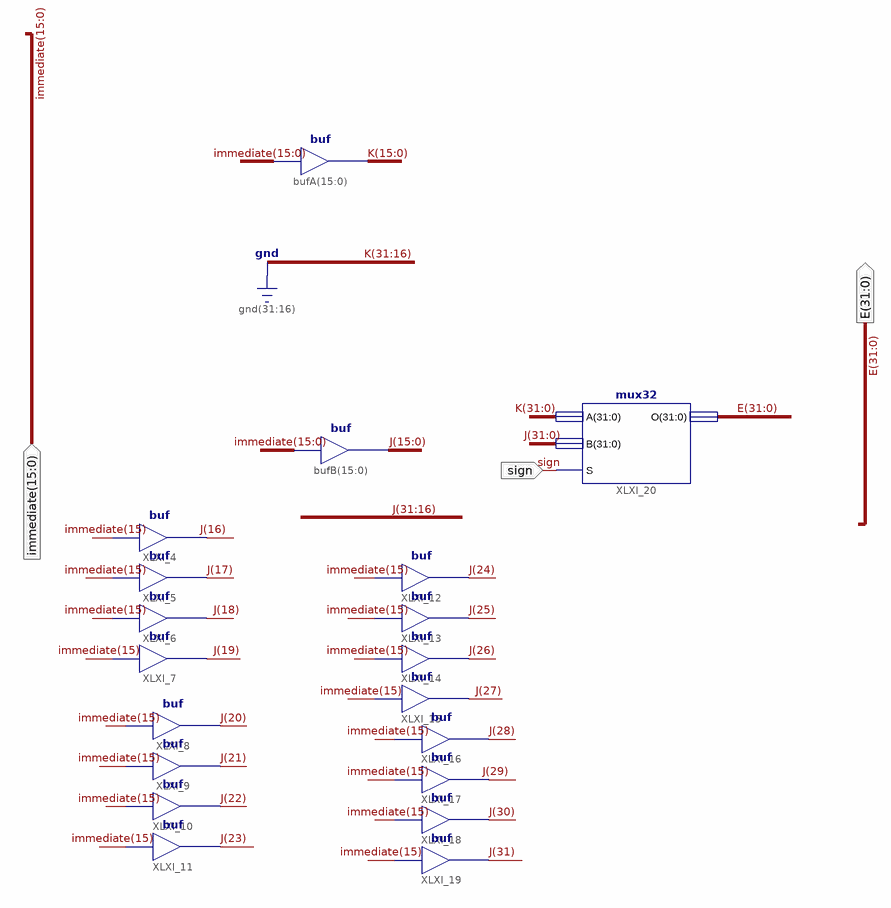
[diagram p0: schematic sheet 1]
// Xilinx ISE schematic expansion16.sch (artix7) as structural Verilog: 19 symbols, 3 ports
module expansion16 (
  input  [15:0] immediate,
  input  sign,
  output [31:0] E
);

  wire [15:0] K;
  wire [31:0] J;

  assign K = immediate;  // buf bufA[15..0], 16 bits wide
  assign J[15:0] = immediate;  // buf bufB[15..0], 16 bits wide
  buf XLXI_4 (J[16], immediate[15]);
  buf XLXI_5 (J[17], immediate[15]);
  buf XLXI_6 (J[18], immediate[15]);
  buf XLXI_7 (J[19], immediate[15]);
  buf XLXI_8 (J[20], immediate[15]);
  buf XLXI_9 (J[21], immediate[15]);
  buf XLXI_10 (J[22], immediate[15]);
  buf XLXI_11 (J[23], immediate[15]);
  buf XLXI_12 (J[24], immediate[15]);
  buf XLXI_13 (J[25], immediate[15]);
  buf XLXI_14 (J[26], immediate[15]);
  buf XLXI_15 (J[27], immediate[15]);
  buf XLXI_16 (J[28], immediate[15]);
  buf XLXI_17 (J[29], immediate[15]);
  buf XLXI_18 (J[30], immediate[15]);
  buf XLXI_19 (J[31], immediate[15]);
  mux32 XLXI_20 (.A({{16{1'b0}}, K}), .B(J), .S(sign), .O(E));
endmodule
